# EasyEDA Pro project ProProject_MinSyBo_Star_2024-05-18.epro

# Schematic 原理图
Create Date: 2024-05-13; Page Name: P1; Project Name: MinSyBo_Star; Schematic Name: 原理图; Update Date: 2024-05-17; Company: 嘉立创EDA; Drawed: DY; Page Size: A4; Version: V1.0
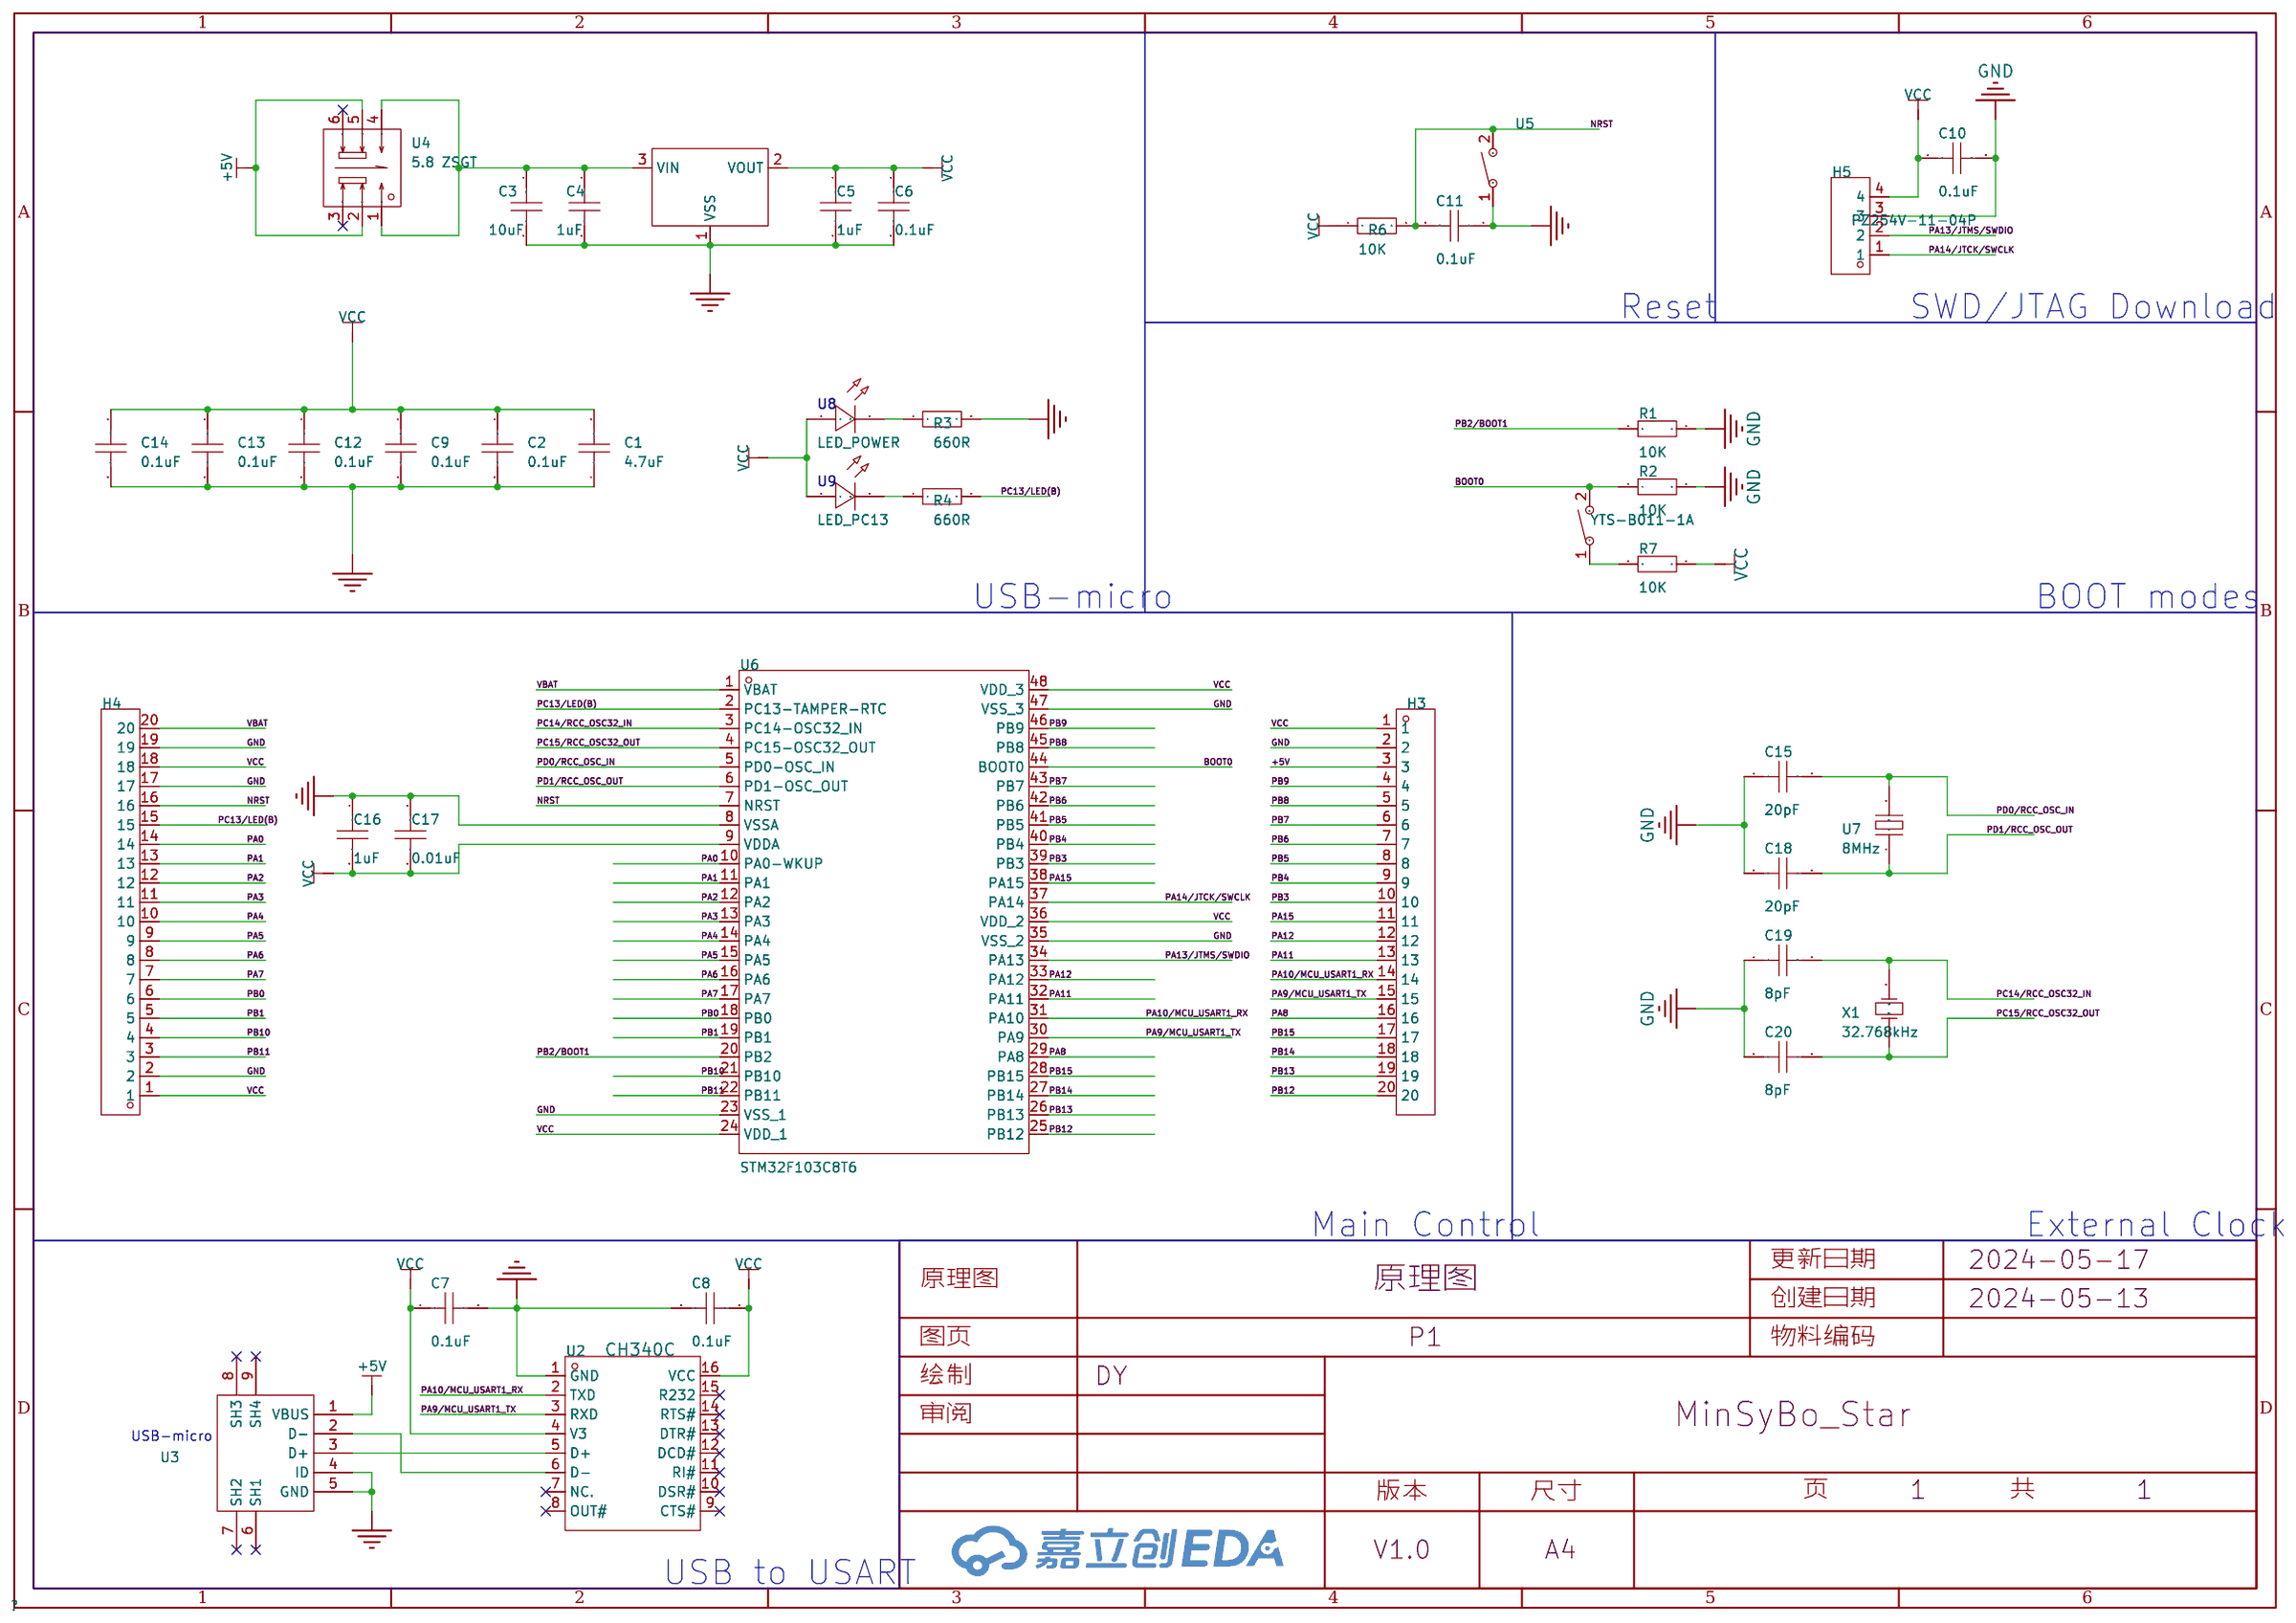
[diagram p0: schematic sheet]

## Parts
BOOT0  YTS-B011-1A  [SW-TH_L6.1-W3.5-P6.60-LS8.0]
C1  4.7uF  [C0603]
C2  100nF  [C0603]
C3  10uF  [C0603]
C4  1uF  [C0603]
C5  1uF  [C0603]
C6  0.1uF  [C0603]
C7  0.1uF  [C0603]
C8  0.1uF  [C0603]
C9  100nF  [C0603]
C10  0.1uF  [C0603]
C11  0.1uF  [C0603]
C12  100nF  [C0603]
C13  100nF  [C0603]
C14  100nF  [C0603]
C15  20pF  [C0603]
C16  1uF  [C0603]
C17  0.01uF  [C0603]
C18  20pF  [C0603]
C19  8pF  [C0603]
C20  8pF  [C0603]
H3  2.54-1*20P直针  [HDR-TH_20P-P2.54-V-M-1]
H4  2.54-1*20P直针  [HDR-TH_20P-P2.54-V-M-1]
H5  PZ254V-11-04P  [HDR-TH_4P-P2.54-V-M]
R1  10K  [R0603]
R2  10K  [R0603]
R3  660R  [R0603]
R4  660R  [R0603]
R6  10K  [R0603]
R7  10K  [R0603]
U1  XC6206P332MR  [SOT-23-3_L2.9-W1.3-P1.90-LS2.4-BR]
U2  CH340C  [SOP-16_L10.0-W3.9-P1.27-LS6.0-BL]
U3  MicroXNJ  [MICRO-USB-SMD_MICROXNJ]
U4  5.8 ZSGT  [SW-TH_5.8ZSGT]
U5  YTS-B011-1A  [SW-TH_L6.1-W3.5-P6.60-LS8.0]
U6  STM32F103C8T6  [LQFP-48_L7.0-W7.0-P0.50-LS9.0-BL]
U7  8MHz  [HC-49SMD_L11.1-W4.8]
U8  LED_POWER  [LED_0603]
U9  LED_PC13  [LED_0603]
X1  32.768kHz  [OSC-TH_BD3.8-P0.50]

## Library data of the parts
BOOT0 = YTS-B011-1A: 电路结构:单刀单掷;按钮形状:矩形按钮;作用力:160gf;安装方式:直插;开关长度:6.1mm;开关宽度:3.5mm;开关高度:4.3mm;带支架:不带;触点电流:50mA;额定电压(DC):12V;绝缘电阻:100MΩ;机械寿命:2万次;; LCSC Part Name: 6.1*3.5*4.3mm 直插 轻触开关; Supplier Part: C2910713; Manufacturer: YIYUAN(怡远); Supplier Footprint: 插件; JLCPCB Part Class: Extended Part; Datasheet: https://atta.szlcsc.com/upload/public/pdf/source/20211129/E22FC470A581AB3D8D68C2E6E06A2474.pdf; Supplier: LCSC; Circuit: 单刀单掷; Actuator Style: 矩形按钮; Operating Force: 160gf; Mounting Style: 直插; Switch Length: 6.1mm; Switch Width: 3.5mm; Switch Height: 4.3mm; Strike Gundam: 不带; Contact Current: 50mA; Voltage Rating (DC): 12V; Insulation Resistance: 100MΩ; Actuator/Cap Color: 白色; Pin Style: PC引脚; Mechanical Life: 2万次; With Lamp: 无; Operating Temperature: -30℃~+85℃
C1 C2 C4-C20 = CAP_0603: Supplier Footprint: 0603; Standardization Check: false; Supplier Part: C14663
C3 = CL10A106KP8NNNC: 容值:10uF;精度:±10%;额定电压:10V;材质(温度系数):X5R;; LCSC Part Name: 10uF ±10% 10V; Supplier Part: C14663; Manufacturer: SAMSUNG(三星); Supplier Footprint: 0603; JLCPCB Part Class: Basic Part; Datasheet: https://atta.szlcsc.com/upload/public/pdf/source/20160218/1457707763339.pdf; Supplier: LCSC; Tolerance: ±10%; Voltage Rated: 10V; Temperature Coefficient: X5R
H3 H4 = 2.54-1*20P直针: 插针结构:1x20P;间距:2.54mm;行距:-;圆针/方针:方针;安装类型:直插;排数:单排;总PIN位数:20P;额定电流:3A;额定电压:-;配合针长度:-;塑高:-;端接针长度:-;触头材质:黄铜;触头镀层:-;工作温度范围:-40℃~+105℃;颜色:黑色;; LCSC Part Name: 间距:2.54mm 1x20P 直插 方针; Supplier Part: C50981; Manufacturer: BOOMELE(博穆精密); Supplier Footprint: 插件,P=2.54mm; JLCPCB Part Class: Extended Part; Datasheet: https://atta.szlcsc.com/upload/public/pdf/source/20151109/1457707572883.pdf; Supplier: LCSC; Pin Structure: 1x20P; Pitch: 2.54mm; Circluar Pins/Square Pins: 方针; Mounting Type: 直插; Number of Rows: 单排; Number of Pins: 20P; Current Rating (Max): 3A; Contact Material: 黄铜; Operating Temperature Range: -40℃~+105℃; Color: 黑色
H5 = PZ254V-11-04P_C492403: 插针结构:1x4P;间距:2.54mm;行距:-;圆针/方针:方针;安装类型:直插;排数:单排;总PIN位数:4P;额定电流:-;额定电压:-;配合针长度:6mm;塑高:2.5mm;端接针长度:3mm;触头材质:黄铜;触头镀层:-;工作温度范围:-40℃~+105℃;颜色:黑色;; LCSC Part Name: 间距:2.54mm 1x4P 直插 方针; Supplier Part: C492403; Manufacturer: XFCN(兴飞); Supplier Footprint: 插件,P=2.54mm; JLCPCB Part Class: Extended Part; Datasheet: https://atta.szlcsc.com/upload/public/pdf/source/20200309/C492403_F9F19131791D08044AD4F84F8E751A34.pdf; Supplier: LCSC; Pin Structure: 1x4P; Pitch: 2.54mm; Circluar Pins/Square Pins: 方针; Mounting Type: 直插; Number of Rows: 单排; Number of Pins: 4P; Length of Mating Pin: 6mm; Insulation Height: 2.5mm; Length of End Connection Pin: 3mm; Contact Material: 黄铜; Operating Temperature Range: -40℃~+105℃; Color: 黑色
R1 R2 R6 R7 = Res_0603: Supplier Footprint: 0603; Standardization Check: false; Supplier Part: C23025
R3 R4 = Res_0603: Supplier Footprint: 0603; Supplier Part: C23025
U1 = XC6206P332MR_C5148692: 输出类型:固定;最大输入电压:8V;输出电压:3.3V;最大输出电流:300mA;输出极性:正极;; LCSC Part Name: 输入8V 输出3.3V 300mA; Supplier Part: C5148692; Manufacturer: HXY MOSFET(华轩阳电子); Supplier Footprint: SOT-23; JLCPCB Part Class: 扩展库; Datasheet: https://atta.szlcsc.com/upload/public/pdf/source/20230315/7D5B35EFFBBF81C2EFC36318D2A1A670.pdf; Supplier: LCSC; Output Type: 固定; Maximum Input Voltage: 8V; Output Voltage: 3.3V; MAX Output Current: 300mA; Dropout Voltage: 240mV@(50mA); Output Polarity: 正极; Number of Outputs: 1
U2 = CH340C: 应用功能:收发器;接口协议:USB 2.0;数据速率:2Mbps;; LCSC Part Name: CH340C USB转串口芯片 CH340; Supplier Part: C84681; Manufacturer: WCH(南京沁恒); Supplier Footprint: SOP-16; Datasheet: https://atta.szlcsc.com/upload/public/pdf/source/20200819/C84681_ADBED554CE321879DBD6B1D06488689C.pdf; Supplier: LCSC; Applications Function: 收发器; Protocol: USB 2.0; Supply Voltage: 3.3V；5V; Data Rate: 2Mbps
U3 = MicroXNJ: 连接器类型:Micro-B;标准:USB 2.0;公母:母;端口数量:1;触点数量:5P;安装方式:卧贴;额定电流 - 电源:1A;工作温度范围:-20℃~+85℃;; LCSC Part Name: Micro-B 母 卧贴; Supplier Part: C404969; Manufacturer: SHOU HAN(首韩); Supplier Footprint: SMD; JLCPCB Part Class: Extended Part; Datasheet: https://atta.szlcsc.com/upload/public/pdf/source/20220415/2494EDFF499AF6F852F7C820374B6AF3.pdf; Supplier: LCSC; Connector Type: Micro-B; Standard: USB 2.0; Gender: 母; Number of Ports: 1; Number of Contacts: 5P; Mounting Style: 卧贴; Current Rating - Power (Max): 1A; Operating Temperature Range: -20℃~+85℃
U4 = 5.8 ZSGT: 电路结构:双刀双掷;自锁/无锁:自锁;安装方式:直插;触点电流:110mA;额定电压 (DC):30V;带灯:不带;作用力:150gf;机械寿命:10万次;; LCSC Part Name: 5.8*5.8有头/高头 带锁/自锁开关 泡泡机开关; Supplier Part: C2681587; Manufacturer: SHOU HAN(首韩); Supplier Footprint: 插件; JLCPCB Part Class: 扩展库; Datasheet: https://atta.szlcsc.com/upload/public/pdf/source/20210107/C2681587_CDDDDA4A1C7AC9FEB01815B75893A6BA.pdf; Supplier: LCSC; Circuit: 双刀双掷; Self Lock / No Lock: 自锁; Actuator Style: 方形按钮; Mounting Style: 直插; Contact Current: 110mA; Voltage Rating (DC): 30V; Insulation Resistance: 100MΩ; Actuator/Cap Color: 白色; With Lamp: 不带; Pin Style: PC引脚; Operating Force: 150gf; Operating Temperature: -10℃~+70℃; Mechanical Life: 10万次
U5 = YTS-B011-1A: 电路结构:单刀单掷;按钮形状:矩形按钮;作用力:160gf;安装方式:直插;开关长度:6.1mm;开关宽度:3.5mm;开关高度:4.3mm;带支架:不带;触点电流:50mA;额定电压(DC):12V;绝缘电阻:100MΩ;机械寿命:2万次;; LCSC Part Name: 6.1*3.5*4.3mm 直插 轻触开关; Supplier Part: C2910713; Manufacturer: YIYUAN(怡远); Supplier Footprint: 插件; JLCPCB Part Class: Extended Part; Datasheet: https://atta.szlcsc.com/upload/public/pdf/source/20211129/E22FC470A581AB3D8D68C2E6E06A2474.pdf; Supplier: LCSC; Circuit: 单刀单掷; Actuator Style: 矩形按钮; Operating Force: 160gf; Mounting Style: 直插; Switch Length: 6.1mm; Switch Width: 3.5mm; Switch Height: 4.3mm; Strike Gundam: 不带; Contact Current: 50mA; Voltage Rating (DC): 12V; Insulation Resistance: 100MΩ; Actuator/Cap Color: 白色; Pin Style: PC引脚; Mechanical Life: 2万次
U6 = STM32F103C8T6: CPU内核:ARM-M3;程序存储容量:64KB;RAM总容量:20KB;GPIO端口数量:37;工作电压范围:2V~3.6V;CPU最大主频:72MHz;程序存储器类型:FLASH;; Supplier Part: C8734; Manufacturer: ST(意法半导体); Supplier Footprint: LQFP-48(7x7); JLCPCB Part Class: 扩展库; Datasheet: https://atta.szlcsc.com/upload/public/pdf/source/20220812/8363ACEC51AD55ECEB84799464F7CB85.pdf; Supplier: LCSC; CPU Core: ARM-M3; Program Storage Size: 64KB; RAM Size: 20KB; GPIO Ports Number: 37; Operating Voltage Range: 2V~3.6V; CPU Maximum Speed: 72MHz; Program Memory Type: FLASH; Operating Temperature Range: -40℃~+85℃; ADC (Bit): 12bit; Universal Serial Bus: 有; Peripheral/Function: 看门狗；DMA；看门狗；温度传感器; Watchdog: 有; Infrared Data Association: 有; Low-Voltage Detect: 有; Direct Memory Access: 有; Internal Oscillator: 有
U7 = RC08000619: 晶振类型:贴片晶振;频率:8MHz;常温频差:±10ppm;外接负载电容:20pF;频率稳定度(全温):±30ppm;; LCSC Part Name: 8MHz ±10ppm 20pF; Supplier Part: C19173024; Manufacturer: TROQ(创捷); Supplier Footprint: HC-49S-SMD; Datasheet: https://atta.szlcsc.com/upload/public/pdf/source/20231030/EE638514B404DA0C4D347D745AEBACA1.pdf; Supplier: LCSC; Crystal Type: 贴片晶振; Normal temperature Frequency Tolerance: ±10ppm; External load capacitor: 20pF; Frequency Stability(Full temperature range): ±30ppm; Operating Temperature: -40℃~+85℃
U8 = LED_0603-G: Supplier Footprint: 0603; Supplier Part: C965799
U9 = LED_0603-B: Supplier Footprint: 0603; Supplier Part: C965799
X1 = K383276812520: 晶振类型:直插晶振;频率:32.768kHz;常温频差:±20ppm;外接负载电容:12.5pF;频率稳定度(全温):±20ppm;; LCSC Part Name: 32.768kHz ±20ppm 12.5pF; Supplier Part: C368795; Manufacturer: KYX(凯越翔); Supplier Footprint: DT-38; Datasheet: https://atta.szlcsc.com/upload/public/pdf/source/20190218/C368795_B0303523B118954B279FF456DC2D6212.pdf; Supplier: LCSC; Crystal Type: 直插晶振; Normal temperature Frequency Tolerance: ±20ppm; External load capacitor: 12.5pF; Frequency Stability(Full temperature range): ±20ppm; Equivalent Series Resistance (ESR): 70kΩ; Operating Temperature: -20℃~+70℃

## Nets
+5V: H3.3 U3.1(VBUS) U4.2 U4.5
GND: C1.1 C2.2 C3.2 C4.2 C5.2 C6.2 C7.2 C8.1 C9.2 C10.2 C11.1 C12.2 C13.2 C14.2 C15.1 C16.1 C17.1 C18.1 C19.1 C20.1 H3.2 H4.2 H4.17 H4.19 H5.3 R1.1 R2.2 R3.2 U1.1(VSS) U2.1(GND) U3.4(ID) U3.5(GND) U5.1 U6.8(VSSA) U6.23(VSS_1) U6.35(VSS_2) U6.47(VSS_3)
VBAT: H4.20 U6.1(VBAT)
VCC: C1.2 C2.1 C5.1 C6.1 C7.1 C8.2 C9.1 C10.1 C12.1 C13.1 C14.1 C16.2 C17.2 H3.1 H4.1 H4.18 H5.4 R6.1 R7.2 U1.2(VOUT) U2.4(V3) U2.16(VCC) U6.9(VDDA) U6.24(VDD_1) U6.36(VDD_2) U6.48(VDD_3) U8.2(A) U9.2(A)
BOOT0: BOOT0.2 R2.1 U6.44(BOOT0)
NRST: C11.2 H4.16 R6.2 U5.2 U6.7(NRST)
PA0: H4.14 U6.10(PA0-WKUP)
PA1: H4.13 U6.11(PA1)
PA2: H4.12 U6.12(PA2)
PA3: H4.11 U6.13(PA3)
PA4: H4.10 U6.14(PA4)
PA5: H4.9 U6.15(PA5)
PA6: H4.8 U6.16(PA6)
PA7: H4.7 U6.17(PA7)
PA8: H3.16 U6.29(PA8)
PA9/MCU_USART1_TX: H3.15 U2.3(RXD) U6.30(PA9)
PA10/MCU_USART1_RX: H3.14 U2.2(TXD) U6.31(PA10)
PA11: H3.13 U6.32(PA11)
PA12: H3.12 U6.33(PA12)
PA13/JTMS/SWDIO: H5.2 U6.34(PA13)
PA14/JTCK/SWCLK: H5.1 U6.37(PA14)
PA15: H3.11 U6.38(PA15)
PB0: H4.6 U6.18(PB0)
PB1: H4.5 U6.19(PB1)
PB2/BOOT1: R1.2 U6.20(PB2)
PB3: H3.10 U6.39(PB3)
PB4: H3.9 U6.40(PB4)
PB5: H3.8 U6.41(PB5)
PB6: H3.7 U6.42(PB6)
PB7: H3.6 U6.43(PB7)
PB8: H3.5 U6.45(PB8)
PB9: H3.4 U6.46(PB9)
PB10: H4.4 U6.21(PB10)
PB11: H4.3 U6.22(PB11)
PB12: H3.20 U6.25(PB12)
PB13: H3.19 U6.26(PB13)
PB14: H3.18 U6.27(PB14)
PB15: H3.17 U6.28(PB15)
PC13/LED(B): H4.15 R4.2 U6.2(PC13-TAMPER-RTC)
PC14/RCC_OSC32_IN: C19.2 U6.3(PC14-OSC32_IN) X1.2(OSC2)
PC15/RCC_OSC32_OUT: C20.2 U6.4(PC15-OSC32_OUT) X1.1(OSC1)
PD0/RCC_OSC_IN: C15.2 U6.5(PD0-OSC_IN) U7.2(GND)
PD1/RCC_OSC_OUT: C18.2 U6.6(PD1-OSC_OUT) U7.1
$1N7601: R3.1 U8.1(C)
$1N7627: R4.1 U9.1(C)
$1N8327: U2.5(D+) U3.3(D+)
$1N8354: U2.6(D-) U3.2(D-)
$1N13397: BOOT0.1 R7.1
$1N13854: C3.1 C4.1 U1.3(VIN) U4.1 U4.4

Not connected (* = marked no-connect by the designer): U2 7(NC.)* 8(OUT#)* 9(CTS#)* 10(DSR#)* 11(RI#)* 12(DCD#)* 13(DTR#)* 14(RTS#)* 15(R232)*; U3 6(SH1)* 7(SH2)* 8(SH3)* 9(SH4)*; U4 3* 6*

## Notes on the sheet
- Reset
- SWD/JTAG Download
- USB-micro
- BOOT modes
- Main Control
- External Clock
- USB-micro
- USB to USART

# Board PCB1
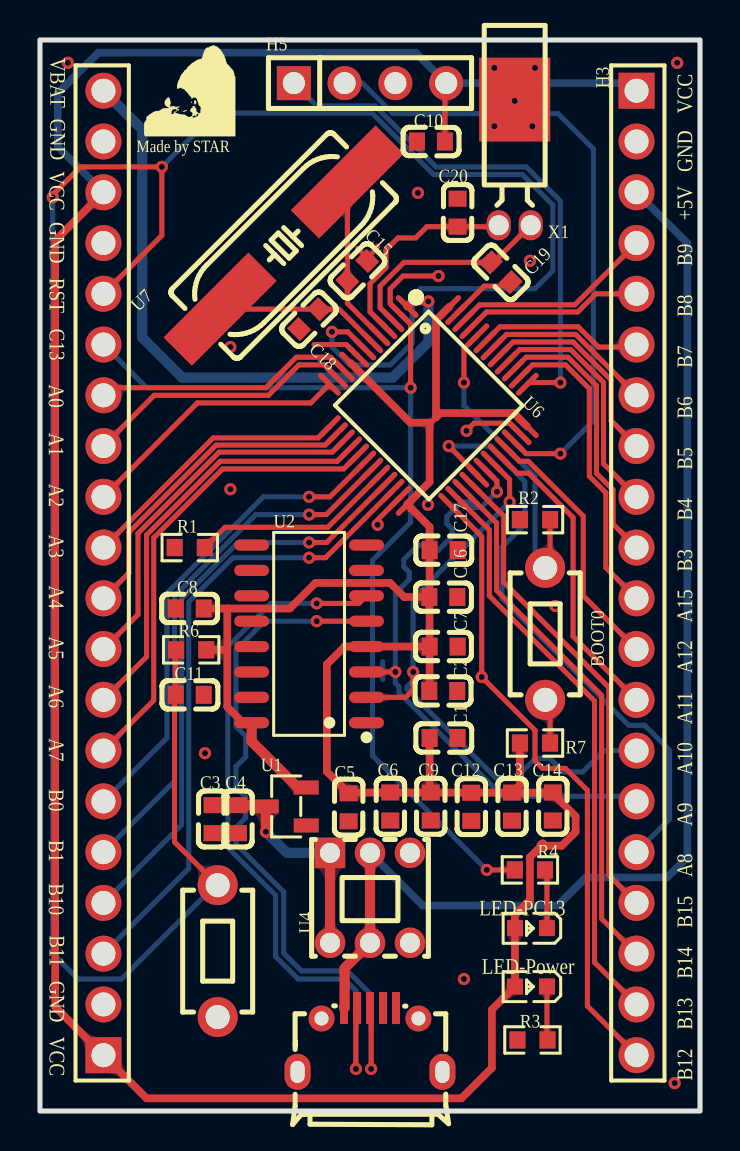
[diagram p1: board, top side]
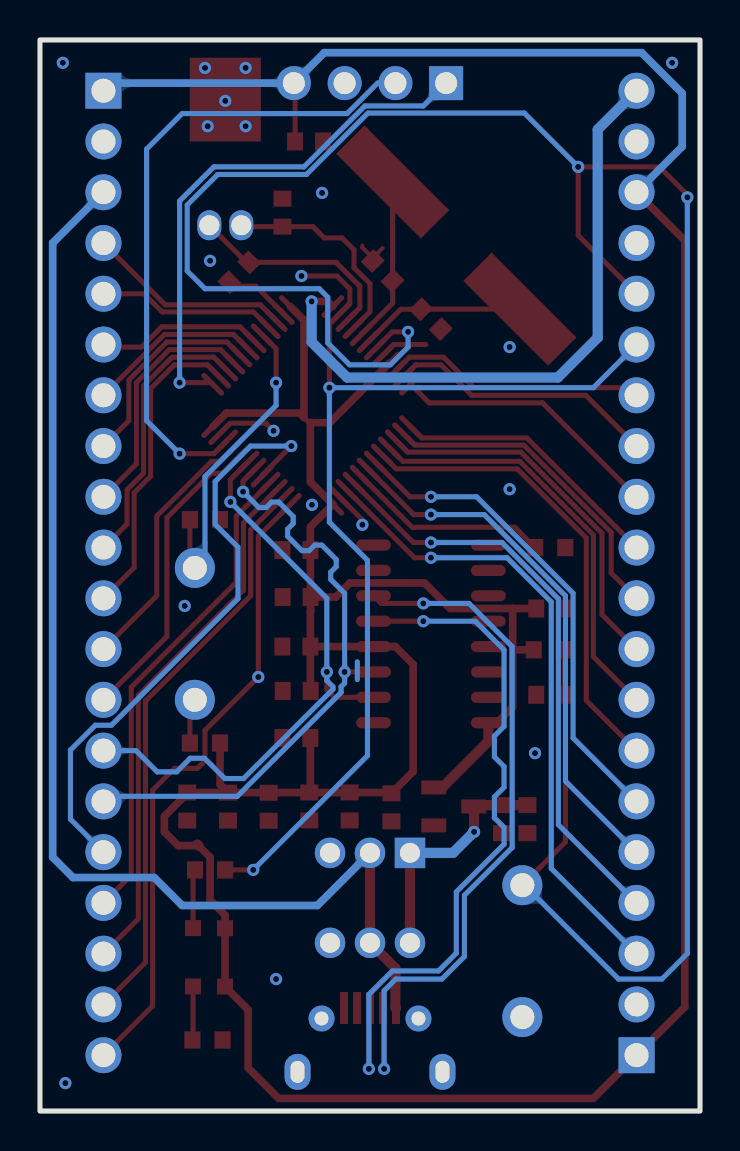
[diagram p2: board, bottom side, seen from below]

Outline 33.02 x 53.59 mm; copper layers: Top Layer, Bottom Layer. Coordinates in mm from the lower left corner of the outline.
Outline path: rectangle 0,53.59 33.02,0
Stack: Top Layer 0.035mm / Dielectric1 1.51mm FR4 er 4.5 / Bottom Layer 0.035mm

## Design rules (mm)
net PC14/RCC_OSC32_IN: DP4
net PC15/RCC_OSC32_OUT: DP4
net PD0/RCC_OSC_IN: DP3
net PD1/RCC_OSC_OUT: DP3
net PA9/MCU_USART1_TX: DP2
net PA10/MCU_USART1_RX: DP2
net $1N8327: DP1
net $1N8354: DP1
template: JLCPCB Capability(Two Layers Board)
spacing copperThickness1oz (default): track to track 0.102, other pairs 0.152 to 0.3
spacing copperThickness2oz: track to track 0.203, other pairs 0.152 to 0.3
track width copperThickness1oz (default): min 0.127, default 0.254, max 2.54
track width copperThickness2oz: min 0.203, default 0.254, max 2.54
differential pair differentialPair (default): width min 0.127, default 0.254, max 2.54; gap min 0.152, default 0.152
via viaSize (default): diameter min 0.5, default 0.61, max 10; hole min 0.3, default 0.305, max 6.3

## Placement (name value [footprint] x y rotation side)
BOOT0  YTS-B011-1A  [SW-TH_L6.1-W3.5-P6.60-LS8.0]  25.27 23.88 90 top
C1  4.7uF  [C0603]  20.19 18.67 180 top
C2  100nF  [C0603]  20.18 21.02 0 top
C3  10uF  [C0603]  8.64 14.61 270 top
C4  1uF  [C0603]  9.91 14.61 270 top
C5  1uF  [C0603]  15.44 15.2 270 top
C6  0.1uF  [C0603]  17.53 15.24 270 top
C7  0.1uF  [C0603]  20.19 23.24 0 top
C8  0.1uF  [C0603]  7.49 25.15 0 top
C9  100nF  [C0603]  19.55 15.24 270 top
C10  0.1uF  [C0603]  19.56 48.51 180 top
C11  0.1uF  [C0603]  7.49 20.83 180 top
C12  100nF  [C0603]  21.58 15.22 270 top
C13  100nF  [C0603]  23.61 15.23 270 top
C14  100nF  [C0603]  25.65 15.24 270 top
C15  20pF  [C0603]  15.88 42.04 225 top
C16  1uF  [C0603]  20.18 25.72 180 top
C17  0.01uF  [C0603]  20.19 28.07 180 top
C18  20pF  [C0603]  13.46 39.62 45 top
C19  8pF  [C0603]  23.05 41.97 135 top
C20  8pF  [C0603]  20.89 44.95 270 top
H3  2.54-1*20P直针  [HDR-TH_20P-P2.54-V-M-1]  29.84 26.92 270 top
H4  2.54-1*20P直针  [HDR-TH_20P-P2.54-V-M-1]  3.18 26.92 90 top
H5  PZ254V-11-04P  [HDR-TH_4P-P2.54-V-M]  16.51 51.44 0 top
NOREF  -  [Pad_e86686]  23.75 50.61 0 top
R1  10K  [R0603]  7.49 28.19 0 top
R2  10K  [R0603]  24.76 29.59 180 top
R3  660R  [R0603]  24.64 3.56 180 top
R4  660R  [R0603]  24.51 12.06 180 top
R6  10K  [R0603]  7.56 23.08 180 top
R7  10K  [R0603]  24.76 18.42 180 top
U1  XC6206P332MR  [SOT-23-3_L2.9-W1.3-P1.90-LS2.4-BR]  12.32 15.24 0 top
U2  CH340C  [SOP-16_L10.0-W3.9-P1.27-LS6.0-BL]  13.46 23.88 90 top
U3  MicroXNJ  [MICRO-USB-SMD_MICROXNJ]  16.51 3.56 0 top
U4  5.8 ZSGT  [SW-TH_5.8ZSGT]  16.51 10.67 180 top
U5  YTS-B011-1A  [SW-TH_L6.1-W3.5-P6.60-LS8.0]  8.89 8 270 top
U6  STM32F103C8T6  [LQFP-48_L7.0-W7.0-P0.50-LS9.0-BL]  19.43 35.31 225 top
U7  8MHz  [HC-49SMD_L11.1-W4.8]  12.19 43.31 45 top
U8  LED_POWER  [LED_0603]  24.51 6.22 180 top
U9  LED_PC13  [LED_0603]  24.51 9.14 180 top
X1  32.768kHz  [OSC-TH_BD3.8-P0.50]  23.75 44.32 0 top

## Footprints (pads in the part's own frame, mm; a bottom-side part is the same pattern mirrored in y, then rotated)
C0603
  rect 0.8x0.9 smd: 1(-0.7,0) 2(0.7,0)
HC-49SMD_L11.1-W4.8
  rect 6x2 smd: 1(-4.5,0) 2(4.5,0)
HDR-TH_4P-P2.54-V-M
  rect 1.7x1.7 hole 1.1: 1(-3.81,0)
  round 1.7 hole 1.1: 2(-1.27,0) 3(1.27,0) 4(3.81,0)
HDR-TH_20P-P2.54-V-M-1
  rect 1.8x1.8 hole 1.2: 1(-24.13,0)
  round 1.8 hole 1.2: 2(-21.59,0) 3(-19.05,0) 4(-16.51,0) 5(-13.97,0) 6(-11.43,0) 7(-8.89,0) 8(-6.35,0) 9(-3.81,0) 10(-1.27,0) 11(1.27,0) 12(3.81,0) 13(6.35,0) 14(8.89,0) 15(11.43,0) 16(13.97,0) 17(16.51,0) 18(19.05,0) 19(21.59,0) 20(24.13,0)
LED_0603
  rect 0.8x0.8 smd: 1(-0.851,-0.01) 2(0.75,-0.005)
LQFP-48_L7.0-W7.0-P0.50-LS9.0-BL
  oval 0.27x1.5 smd: 1(-2.75,-4.25) 2(-2.25,-4.25) 3(-1.75,-4.25) 4(-1.25,-4.25) 5(-0.75,-4.25) 6(-0.25,-4.25) 7(0.25,-4.25) 8(0.75,-4.25) 9(1.25,-4.25) 10(1.75,-4.25) 11(2.25,-4.25) 12(2.75,-4.25) 25(2.75,4.25) 26(2.25,4.25) 27(1.75,4.25) 28(1.25,4.25) 29(0.75,4.25) 30(0.25,4.25) 31(-0.25,4.25) 32(-0.75,4.25) 33(-1.25,4.25) 34(-1.75,4.25) 35(-2.25,4.25) 36(-2.75,4.25)
  oval 1.5x0.27 smd: 13(4.25,-2.75) 14(4.25,-2.25) 15(4.25,-1.75) 16(4.25,-1.25) 17(4.25,-0.75) 18(4.25,-0.25) 19(4.25,0.25) 20(4.25,0.75) 21(4.25,1.25) 22(4.25,1.75) 23(4.25,2.25) 24(4.25,2.75) 37(-4.25,2.75) 38(-4.25,2.25) 39(-4.25,1.75) 40(-4.25,1.25) 41(-4.25,0.75) 42(-4.25,0.25) 43(-4.25,-0.25) 44(-4.25,-0.75) 45(-4.25,-1.25) 46(-4.25,-1.75) 47(-4.25,-2.25) 48(-4.25,-2.75)
MICRO-USB-SMD_MICROXNJ
  rect 0.4x1.6 smd: 1(-1.3,1.597) 2(-0.65,1.597) 3(0,1.597) 4(0.65,1.597) 5(1.3,1.597)
  round 1.3 hole 0.7: 6(2.425,1.074) 9(-2.425,1.073)
  oval 1.3x1.8 hole 0.7x1.1: 7(3.625,-1.597) 8(-3.625,-1.597)
OSC-TH_BD3.8-P0.50
  oval 1.2x1.5 hole 1: 1(-0.8,0) 2(0.8,0)
Pad_e86686
  custom 3.556x4.191 smd: 49(0,0)
R0603
  rect 0.806x0.864 smd: 1(-0.753,0) 2(0.753,0)
SOP-16_L10.0-W3.9-P1.27-LS6.0-BL
  oval 0.56x1.745 smd: 1(-4.445,-2.873) 2(-3.175,-2.873) 3(-1.905,-2.873) 4(-0.635,-2.873) 5(0.635,-2.873) 6(1.905,-2.873) 7(3.175,-2.873) 8(4.445,-2.873) 9(4.445,2.873) 10(3.175,2.873) 11(1.905,2.873) 12(0.635,2.873) 13(-0.635,2.873) 14(-1.905,2.873) 15(-3.175,2.873) 16(-4.445,2.873)
SOT-23-3_L2.9-W1.3-P1.90-LS2.4-BR
  rect 1.25x0.7 smd: 1(1,-0.95) 2(1,0.95) 3(-1,0)
SW-TH_5.8ZSGT
  rect 1.524x1.524 hole 1: 1(2,-2.25)
  round 1.524 hole 1: 2(0,-2.25) 3(-2,-2.25) 4(2,2.25) 5(0,2.25) 6(-2,2.25)
SW-TH_L6.1-W3.5-P6.60-LS8.0
  round 2 hole 1.2: 1(-3.3,0) 2(3.3,0)

## Nets
As in the schematic, except:
GND: C1.1 C2.2 C3.2 C4.2 C5.2 C6.2 C7.2 C8.1 C9.2 C10.2 C11.1 C12.2 C13.2 C14.2 C15.1 C16.1 C17.1 C18.1 C19.1 C20.1 H3.2 H4.2 H4.17 H4.19 H5.3 NOREF.49 R1.1 R2.2 R3.2 U1.1 U2.1 U3.4 U3.5 U5.2 U6.8 U6.23 U6.35 U6.47
NRST: C11.2 H4.16 R6.2 U5.1 U6.7

Pads without a net: U2 7 8 9 10 11 12 13 14 15; U3 6 7 8 9; U4 3 6

## Via types
v1: diameter 0.61, hole 0.305, Top Layer to Bottom Layer, 43 vias

## Routing (per net, layer and track width the routed paths; a pad name or vN(x,y) marks a point on that pad's centre or on a via; arc(x,y) is an arc through that point)
+5V: length 60.6
  Top Layer w0.508: U4.2 U4.5 15.24,7.15 15.24,5.18 U3.1
  Bottom Layer w0.381: U4.2 19.14,10.29 25.91,10.29 27.31,11.68 31.37,11.68 32.38,12.7 32.38,43.43 H3.3
GND: length 13.3
  Top Layer w0.203: C15.1 16.37,42.69 ; 16.37,42.69 15.88,43.18 ; 16.37,42.69 16.89,43.21 16.89,43.31
  Top Layer w0.254: U6.8 15.32,38.35 13.72,38.35 ; 23.55,41.48 23.34,41.28 22.22,41.28 20.84,39.9 ; U6.23 16.89,29.58 v1(16.89,29.34) ; v1(21.34,34.04) 21.72,34.42 23.5,34.42 U6.35
  Bottom Layer w0.254: 17.15,22.48 17.15,21.59
  vias: v1(1.4,52.45) v1(8.25,17.91) v1(9.53,38.23) v1(9.53,31.11) v1(18.91,45.94) v1(19.41,30.34) v1(21.21,6.6) v1(22.73,52.2) v1(22.73,49.28) v1(23.75,50.55) v1(24.51,42.55) v1(24.63,49.28) v1(24.76,52.2) v1(25.78,25.27) v1(31.75,1.4) v1(31.88,52.45)
VBAT: length 32.2
  Top Layer w0.381: v1(19.43,40.51) 18.63,40.51 U6.1
  Bottom Layer w0.508: v1(19.43,40.51) 19.43,38.48 17.65,36.7 7.11,36.7 5.12,38.7 5.12,49.11 H4.20
VCC: length 205.3
  Top Layer w0.254: 19.49,34.45 19.56,34.45 19.81,34.7 ; 20.26,48.51 20.26,51.37 H5.4
  Top Layer w0.381: 19.49,23.24 U2.4 15.24,23.24 14.35,22.35 14.35,16.99 C5.1 15.47,15.93 23.61,15.93 ; 19.49,23.24 19.49,25 19.48,25.01 19.48,25.72 ; 19.49,23.24 19.49,21.03 C2.1 ; C9.1 19.49,16 19.49,18.67 ; R7.2 24.01,16.33 23.61,15.93 25.65,15.93 ; 25.65,15.93 25.65,15.93 25.65,15.89 26.8,14.75 26.8,13.97 26.1,13.28 25.09,13.28 24.51,12.7 24.51,10.56 23.76,9.81 U9.2 U8.2 22.61,5.07 22.61,2.16 21.08,0.63 5.33,0.63 H4.1 0.76,5.21 0.76,43.56 H4.18 ; 25.65,15.93 C14.1 ; 9.37,23.09 9.37,20.22 10.16,19.43 U2.16 ; 9.37,23.09 9.36,23.08 R6.1 ; 9.37,23.09 9.37,25.12 ; U6.36 23.7,34.92 20.03,34.92 19.81,34.7 19.81,39.58 U6.48 ; 9.37,25.12 9.39,25.15 12.5,25.15 13.78,26.42 17.52,26.42 18.22,25.72 C16.2 19.49,25.73 19.49,29.23 U6.24 19.49,31.48 19.49,34.45 19.49,34.44 18.52,34.44 U6.9 ; 9.37,25.12 9.35,25.15 8.19,25.15
  Top Layer w0.508: U1.2 12.89,16.19 10.59,18.49 U2.16 ; 25.09,13.28 25.15,13.33
  Bottom Layer w0.381: H3.1 29.46,51.44 H5.4 18.8,52.96 2.92,52.96 0.89,50.93 0.89,48.26 H4.18
BOOT0: length 16.2
  Top Layer w0.254: 21.91,38.84 21.21,38.15 v1(21.21,36.45) ; BOOT0.2 25.52,27.42 R2.1
  Bottom Layer w0.254: v1(21.21,36.45) 21.21,35.31 24.76,31.75 24.76,27.68 BOOT0.2
NRST: length 118.3
  Top Layer w0.254: R6.2 6.79,23.06 C11.2 6.73,20.77 6.73,13.46 U5.1 ; 16.25,38.13 15.39,38.99 v1(14.6,38.99) ; v1(0.63,45.72) 0.63,45.85 2.03,47.24 v1(6.1,47.24) 6.1,43.81 H4.16
  Bottom Layer w0.254: v1(14.6,38.99) 14.6,38.23 15.49,37.34 17.53,37.34 18.62,38.44 18.62,40.72 19.05,41.15 24.76,41.15 25.65,42.04 25.65,45.34 24.13,46.86 19.69,46.86 16.62,49.94 8.79,49.94 v1(6.1,47.24) ; v1(0.63,45.72) 0.63,7.87 1.9,6.6 4.08,6.6 8.77,11.3 U5.1
PA0: length 13.1
  Top Layer w0.254: U6.10 14.54,37.72 12.83,37.72 11.31,36.19 3.56,36.19 H4.14
PA1: length 13.6
  Top Layer w0.254: H4.13 5.72,35.81 11.43,35.81 12.96,37.34 14.22,37.34 14.84,36.72
PA2: length 13.6
  Top Layer w0.254: 14.48,36.37 13.55,35.43 7.87,35.43 H4.12
PA3: length 13.8
  Top Layer w0.254: U6.13 13.92,33.68 8.66,33.68 H4.11
PA4: length 16.3
  Top Layer w0.254: H4.10 4.44,26.92 4.44,28.96 8.81,33.32 14.27,33.33 14.84,33.89
PA5: length 18.7
  Top Layer w0.254: U6.15 14.62,32.97 8.96,32.97 4.9,28.91 4.9,24.84 H4.9
PA6: length 21.2
  Top Layer w0.254: H4.8 5.33,22.73 5.33,28.83 9.02,32.51 14.87,32.51 U6.16
PA7: length 23.6
  Top Layer w0.254: U6.17 15.19,32.13 9.14,32.13 5.69,28.68 5.69,20.55 H4.7
PA8: length 30.3
  Top Layer w0.254: 21.91,31.77 21.91,31.82 v1(20.45,33.27)
  Bottom Layer w0.254: v1(20.45,33.27) 22.48,33.27 24.26,31.5 24.26,29.36 23.11,28.21 23.11,25.64 29.45,19.3 30.25,19.3 31.5,18.06 31.5,14.61 H3.16
PA9/MCU_USART1_TX: length 31.7
  Top Layer w0.254: v1(17.78,21.97) U2.3 ; v1(22.86,30.99) 22.86,31.52 U6.30
  Bottom Layer w0.254: H3.15 29.84,15.66 29.75,15.75 23.15,15.75 17.96,20.94 17.96,21.23 17.78,21.41 v1(17.78,21.97) 17.78,25.91 18.48,26.6 18.48,26.96 18.2,27.24 18.2,27.6 18.92,28.32 19.28,28.32 19.55,28.04 19.91,28.04 20.63,28.76 20.63,29.12 20.35,29.39 20.35,29.75 21.07,30.47 21.43,30.47 21.71,30.2 22.07,30.2 v1(22.86,30.99)
PA10/MCU_USART1_RX: length 31.7
  Top Layer w0.254: 22.61,32.48 23.5,31.59 v1(23.5,30.48) ; v1(18.67,21.97) 18.67,21.08 18.29,20.7 16.33,20.7
  Bottom Layer w0.254: H3.14 28.22,18.03 27.15,16.97 26.19,16.97 25.5,17.65 24.79,17.65 23.77,16.64 22.83,16.64 18.36,21.11 18.36,21.23 18.67,21.54 v1(18.67,21.97) 18.67,25.65 v1(23.5,30.48)
PA11: length 15.4
  Top Layer w0.254: H3.13 26.67,23.75 26.67,29.69 24.45,31.92 23.88,31.92 U6.32
PA12: length 13
  Top Layer w0.254: U6.33 23.99,32.51 24.43,32.51 27.18,29.77 27.18,25.78 H3.12
PA13/JTMS/SWDIO: length 32.4
  Top Layer w0.254: U6.34 24.32,32.89 v1(26.03,32.89)
  Bottom Layer w0.254: H5.2 16.13,51.44 17.65,49.91 25.91,49.91 27.69,48.13 27.69,34.54 v1(26.03,32.89)
PA14/JTCK/SWCLK: length 26.6
  Top Layer w0.254: v1(26.03,36.45) 24.46,36.45 24.38,36.37
  Bottom Layer w0.254: H5.1 13.84,50.29 16.76,50.29 19.81,47.24 24.32,47.24 26.03,45.53 v1(26.03,36.45)
PA15: length 15.7
  Top Layer w0.254: H3.11 28.31,27.19 28.31,30.94 27.48,31.77 27.48,36.15 26.29,37.34 24.65,37.34 U6.38
PB0: length 24.3
  Top Layer w0.254: 16.25,32.48 14.51,30.73 v1(13.46,30.73)
  Bottom Layer w0.254: v1(13.46,30.73) 11.18,30.73 6.35,25.91 6.35,18.67 H4.6
PB1: length 26.8
  Top Layer w0.254: v1(13.46,29.84) 14.32,29.84 U6.19
  Bottom Layer w0.254: H4.5 6.73,16.51 6.73,25.78 10.79,29.84 v1(13.46,29.84)
PB2/BOOT1: length 10.2
  Top Layer w0.254: U6.20 14.4,29.21 9.26,29.21 R1.2
PB3: length 14
  Top Layer w0.254: 23.67,37.07 24.32,37.72 26.42,37.72 27.84,36.3 27.84,31.91 28.67,31.09 28.67,29.37 H3.10
PB4: length 12.2
  Top Layer w0.254: H3.9 28.19,32.39 28.19,36.45 26.55,38.1 23.99,38.1 U6.40
PB5: length 10.5
  Top Layer w0.254: U6.41 23.67,38.48 26.67,38.48 28.57,36.58 28.57,34.54 H3.8
PB6: length 8.8
  Top Layer w0.254: H3.7 26.8,38.86 23.34,38.86 22.61,38.14
PB7: length 8.4
  Top Layer w0.254: H3.6 29.72,38.23 27.94,38.23 26.92,39.24 23.01,39.24 U6.43
PB8: length 9
  Top Layer w0.254: H3.5 27.81,40.89 26.9,39.98 22.34,39.98 U6.45
PB9: length 10.3
  Top Layer w0.254: H3.4 26.75,40.34 21.99,40.34 21.2,39.55
PB10: length 29.5
  Top Layer w0.254: v1(13.46,28.45) 14.34,28.45 U6.21
  Bottom Layer w0.254: H4.4 7.09,14.33 7.09,25.63 9.91,28.45 v1(13.46,28.45)
PB11: length 31.9
  Top Layer w0.254: U6.22 14.28,27.69 v1(13.46,27.69)
  Bottom Layer w0.254: v1(13.46,27.69) 9.65,27.69 7.44,25.48 7.44,12.14 H4.3
PB12: length 32.1
  Top Layer w0.254: H3.20 27.39,5.25 27.39,16.05 26.29,17.14 25.15,17.14 24.76,17.53 24.76,19.05 v1(22.1,21.72) 22.1,28.75 U6.25
PB13: length 29.1
  Top Layer w0.254: 20.85,30.71 22.48,29.08 22.48,25.78 27.74,20.52 27.74,7.44 H3.19
PB14: length 26.8
  Top Layer w0.254: 21.2,31.06 22.84,29.42 22.84,26.06 28.1,20.8 28.1,9.62 H3.18
PB15: length 24.4
  Top Layer w0.254: H3.17 28.46,11.8 28.46,21.2 23.2,26.46 23.2,29.77 21.55,31.42
PC13/LED(B): length 53
  Top Layer w0.254: U6.2 17.52,40.4 17.52,41.14 18.16,41.78 v1(19.94,41.78) ; v1(18.54,36.19) 18.54,39.38 18.02,39.9 ; v1(22.35,12.06) 23.76,12.06
  Bottom Layer w0.254: v1(22.35,12.06) 16.64,17.78 16.64,27.56 18.54,29.46 v1(18.54,36.19) 5.33,36.19 H4.15
PC14/RCC_OSC32_IN: length 10.8
  Top Layer w0.254: X1.2 22.69,42.47 18.21,42.47 17.02,41.28 17.02,40.19 U6.3
PC15/RCC_OSC32_OUT: length 10.7
  Top Layer w0.254: U6.4 16.51,39.99 16.51,41.4 17.31,42.2 17.31,43.09 17.91,43.69 18.8,43.69 19.36,44.25 C20.2 22.88,44.25 X1.1
PD0/RCC_OSC_IN: length 8.3
  Top Layer w0.254: U6.5 15.38,40.42 C15.2 15.38,46.48 U7.2
PD1/RCC_OSC_OUT: length 8.3
  Top Layer w0.254: U6.6 14.97,40.12 13.96,40.12 13.95,40.12 9.01,40.12
$1N7601: length 2.6
  Top Layer w0.254: 25.36,3.65 U8.1
$1N7627: length 2.9
  Top Layer w0.254: U9.1 25.36,11.97 25.27,12.06
$1N8327: length 36.1
  Top Layer w0.254: U3.3 16.57,5.1 v1(16.57,2.11) ; U2.5 v1(13.84,24.51)
  Bottom Layer w0.254: v1(16.57,2.11) 16.57,5.83 15.39,7.01 13.08,7.01 12.19,7.9 12.19,10.96 9.8,13.35 9.8,14.19 10.29,14.67 10.29,15.72 9.8,16.2 9.8,17.24 10.29,17.72 10.29,18.76 9.8,19.25 9.8,23.07 11.24,24.51 v1(13.84,24.51)
$1N8354: length 36.2
  Top Layer w0.254: v1(13.84,25.4) 15.95,25.4 U2.6 ; U3.2 15.8,5.1 v1(15.8,2.11)
  Bottom Layer w0.254: v1(15.8,2.11) 15.8,6.02 15.22,6.6 12.91,6.6 11.79,7.73 11.79,10.8 9.4,13.18 9.4,23.24 11.56,25.4 v1(13.84,25.4)
$1N13397: length 2.8
  Top Layer w0.254: R7.1 25.52,20.17 24.76,20.92
$1N13854: length 12.1
  Top Layer w0.508: 14.51,8.42 14.51,12.92 ; C3.1 C4.1 11.25,15.31 U1.3 11.3,15.22 v1(11.3,13.97)
  Bottom Layer w0.508: 14.51,12.92 12.35,12.92 v1(11.3,13.97)

## Copper pours and planes (outline as drawn; the poured copper is in the pictures)
GND on Top Layer: -16.89,61.34 55.63,61.34 55.63,-5.84 -16.89,-5.84
GND on Bottom Layer: -17.53,64.64 55.24,64.64 55.24,-5.08 -17.53,-5.08

Small or netless copper shapes (teardrops, artwork), in the pictures only: 214 on Top Layer, 71 on Bottom Layer

## Text on the board
Top Silkscreen Layer: Made by STAR | LED-PC13 | LED-Power | VCC | B9 | B8 | B7 | B6 | B5 | B4 | B3 | A15 | A12 | A11 | A10 | A9 | A8 | B15 | B14 | B13 | B12 | GND | +5V | A0 | A1 | A2 | A3 | A4 | A5 | A6 | A7 | B0 | B1 | B10 | RST | C13 | B11 | VBAT
